# Altium schematic sheet AFE.SchDoc
size A; SheetNumber: 2; SheetTotal: 2
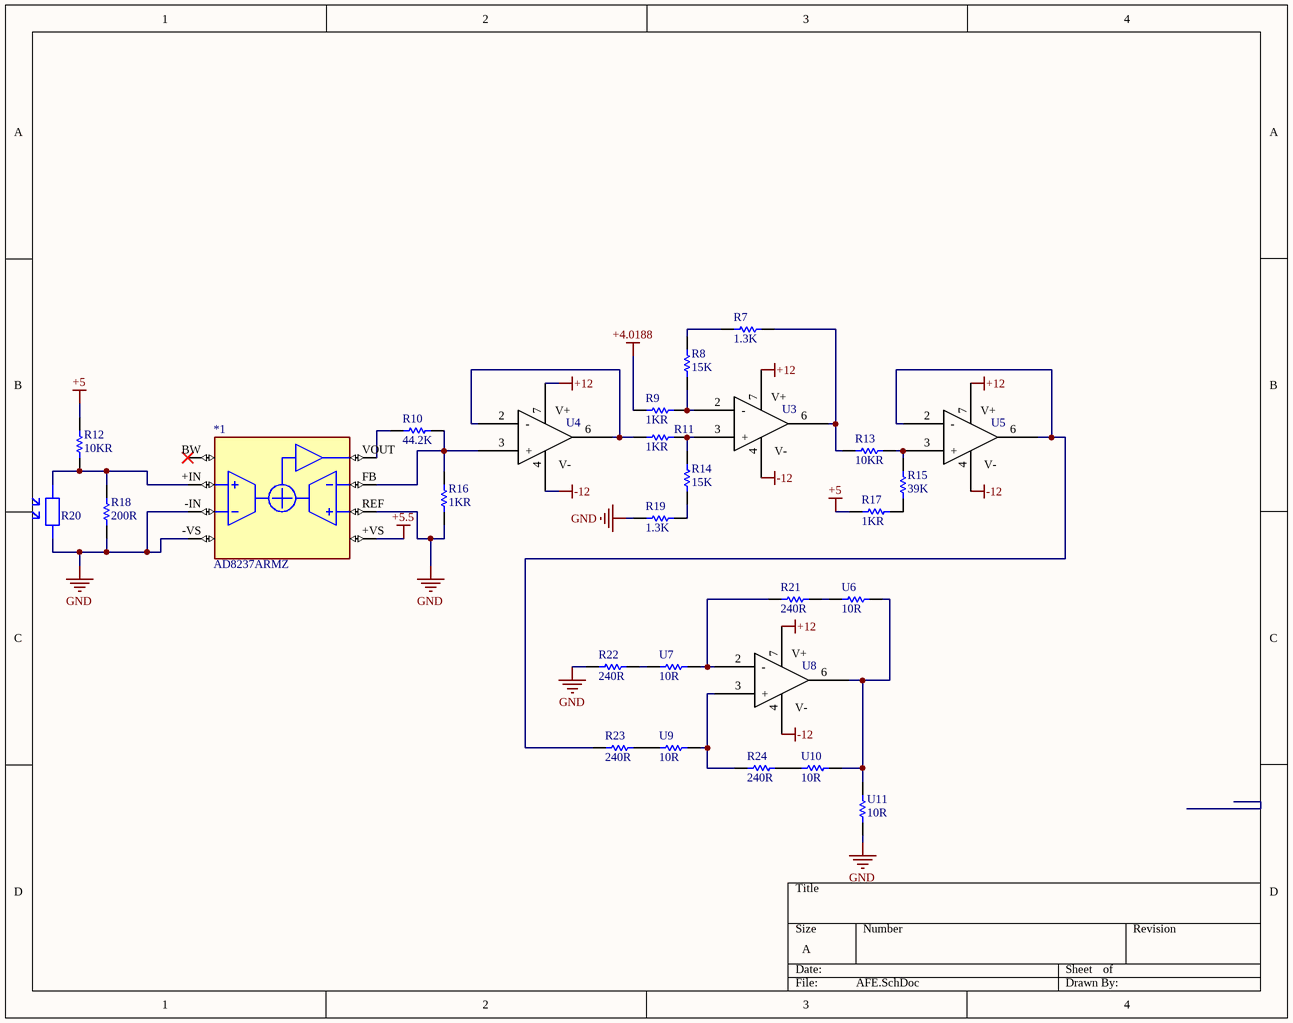
[diagram p0: AFE.SchDoc]

## Parts
*1  AD8237ARMZ  [AD8237ARMZ]
R7  1.3K  [RES_0805]
R8  15K  [RES_0805]
R9  1KR  [RES_0805]
R10  44.2K  [RES_0805]
R11  1KR  [RES_0805]
R12  10KR  [RES_0805]
R13  10KR  [RES_0805]
R14  15K  [RES_0805]
R15  39K  [RES_0805]
R16  1KR  [RES_0805]
R17  1KR  [RES_0805]
R18  200R  [RES_0805]
R19  1.3K  [RES_0805]
R20  GL5528  [GL5528]  (value not drawn)
R21  240R
R22  240R
R23  240R
R24  240R
U3  OPA188AID  [OPA]  (value not drawn)
U4  OPA188AID  [OPA]  (value not drawn)
U5  OPA188AID  [OPA]  (value not drawn)
U6  10R  [RES_0805]
U7  10R  [RES_0805]
U8  OPA188AID  [OPA]  (value not drawn)
U9  10R  [RES_0805]
U10  10R  [RES_0805]
U11  10R  [RES_0805]

## Nets
+4.0188: R9.1
+5: R12.2 R17.1
+5.5: *1.+VS
+12: U3.7(VCC) U4.7(VCC) U5.7(VCC) U8.7(VCC)
-12: U3.4(GND) U4.4(GND) U5.4(GND) U8.4(GND)
GND: *1.-IN *1.-VS *1.REF R16.1 R18.1 R19.2 R20.4 R22.1 U11.1
Net*1_+IN: *1.+IN R12.1 R18.2 R20.5
Net*1_FB: *1.FB R10.2 R16.2 U4.3(+)
Net*1_VOUT: *1.VOUT R10.1
NetR7_1: R7.1 R8.2
NetR7_2: R7.2 R13.1 U3.6(OUT_1)
NetR8_1: R8.1 R9.2 U3.2(-)
NetR11_1: R11.1 U4.2(-) U4.6(OUT_1)
NetR11_2: R11.2 R14.2 U3.3(+)
NetR13_2: R13.2 R15.1 U5.3(+)
NetR14_1: R14.1 R19.1
NetR15_2: R15.2 R17.2
NetR21_1: R21.1 U7.2 U8.2(-)
NetR21_2: R21.2 U6.1
NetR22_2: R22.2 U7.1
NetR23_1: R23.1 U5.2(-) U5.6(OUT_1)
NetR23_2: R23.2 U9.1
NetR24_1: R24.1 U8.3(+) U9.2
NetR24_2: R24.2 U10.1
NetU6_2: U6.2 U8.6(OUT_1) U10.2 U11.2

Not connected (* = marked no-connect by the designer): *1 BW*

## Notes on the sheet
- (in symbol OPA188AID) V+; V-

## Library data of the parts
R7 R19 = RES_1.3K_0805: Điện Trở 1.3 KOhm 0805 5%
R8 R14 = RES_15K_0805: Điện Trở 15 KOhm 0805 1%
R9 R11 R16 R17 = RES_1K_0805: Điện Trở 1 KOhm 0805 1%
R10 = RES_44.2K_0805: Điện Trở 44.2 KOhm 0805 1%
R12 R13 = RES_10K_0805: Điện Trở 10 KOhm 0805 1%
R15 = RES_39K_0805: Điện Trở 39 KOhm 0805 1%
R18 = RES_200_0805: Điện Trở 220 Ohm 0805 1%
R20 = GL5528: CDS PHOTORESISTOR
R21-R24 = RES_240R_0805: Điện Trở 240 Ohm 0805 5%
U3-U5 U8 = OPA188AID: IC OPAMP ZERO-DRIFT 1 CIRC 8SOIC
U6 U7 U9-U11 = RES_10R_0805: Điện Trở 10 Ohm 0805 1%